# EAGLE design 516_lora_arduino_CMWX1ZZABZ (EAGLE 9.6.2)
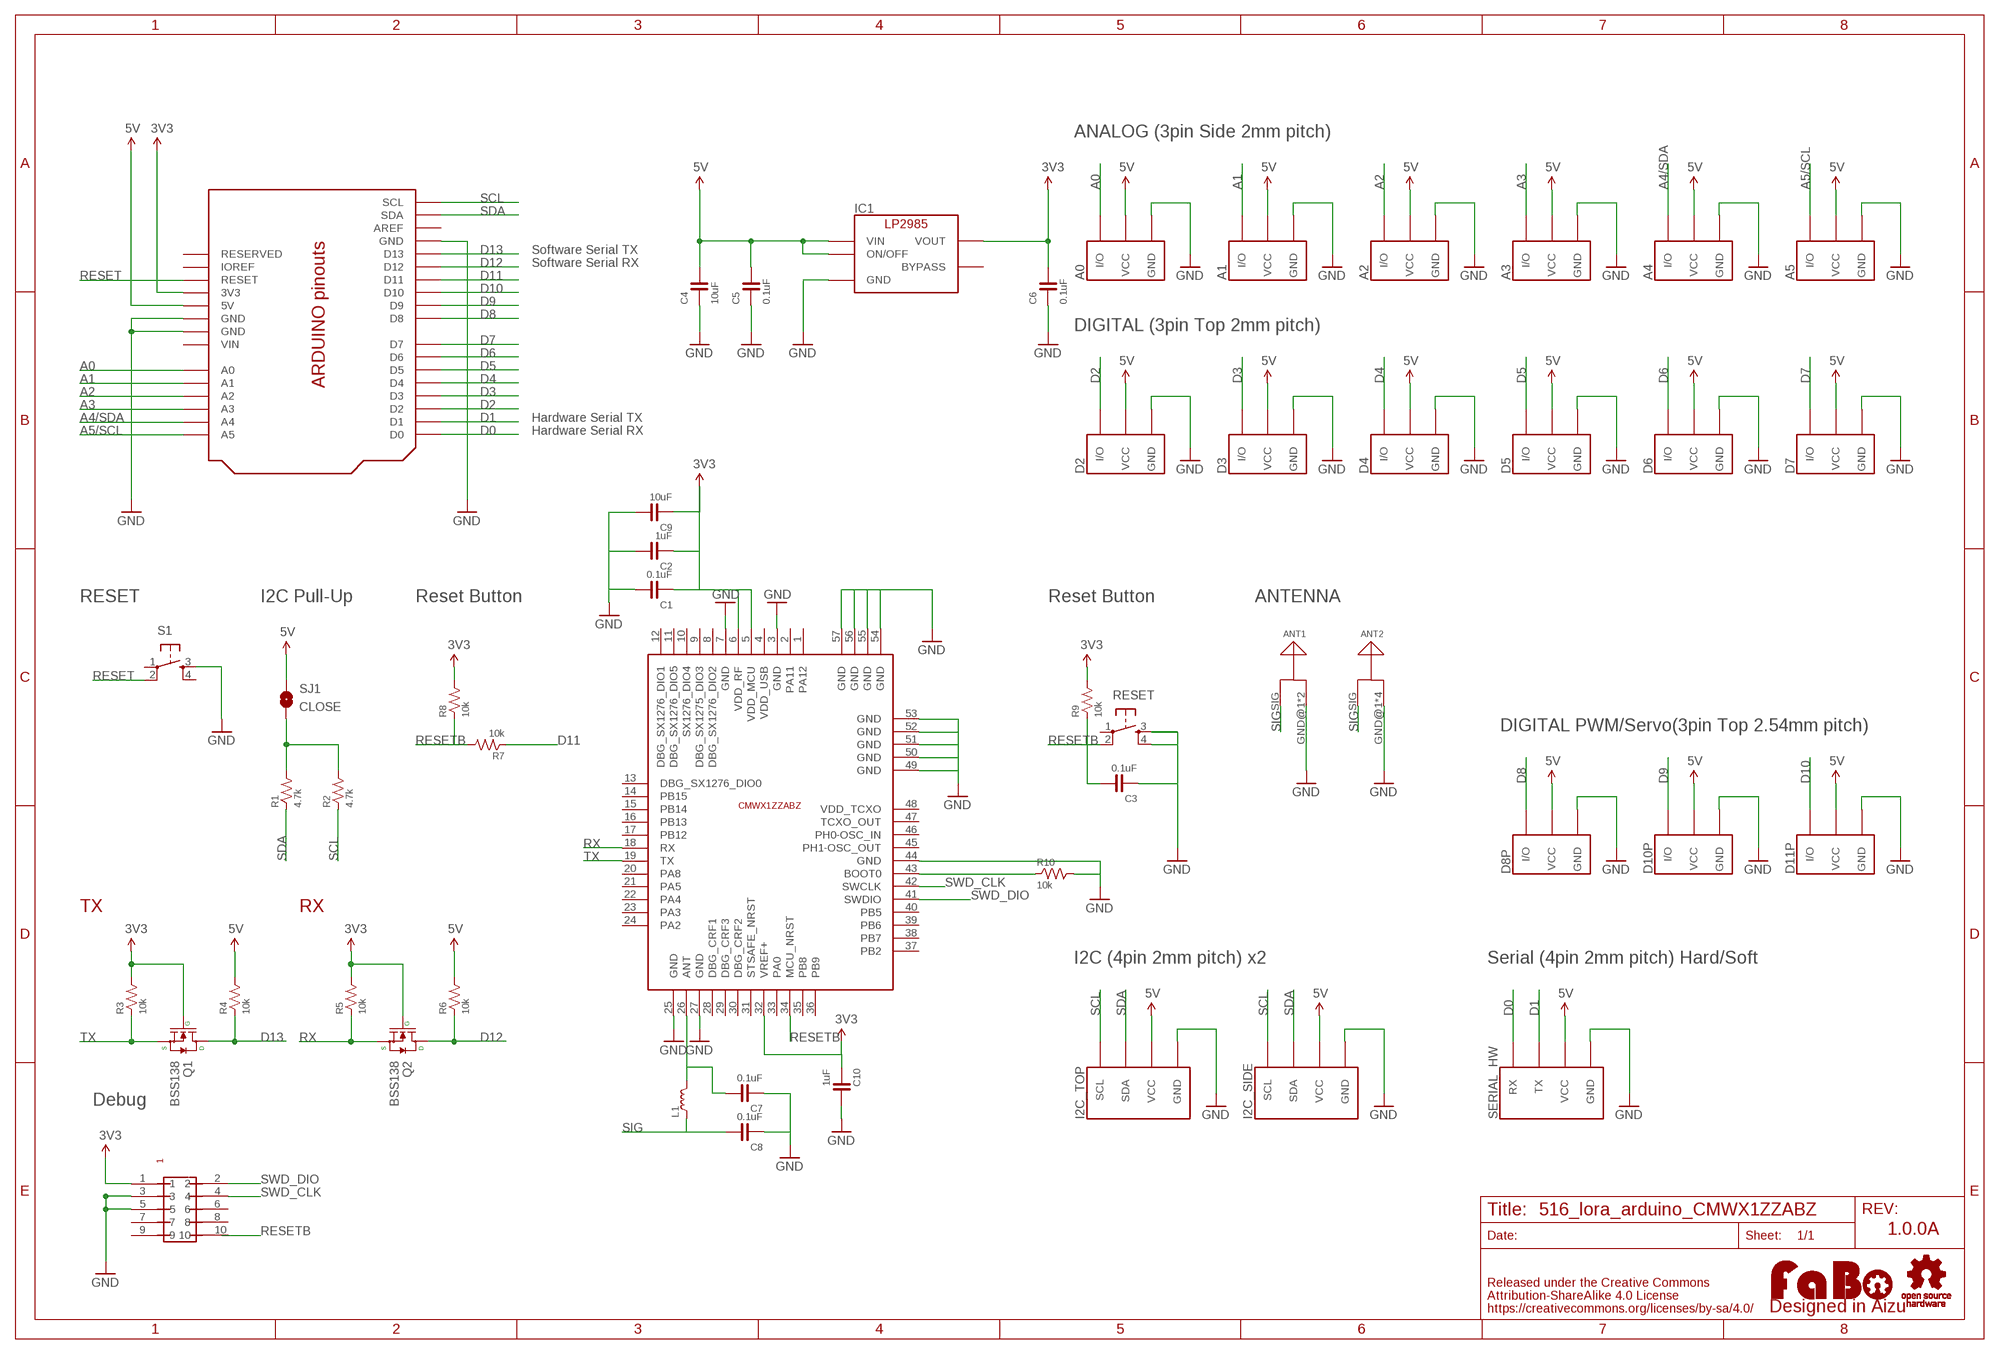
[diagram p0: schematic, sheet 1]

## Parts
A0  FABO_BRICK_3PIN-S03B-PASK-2_LONG  [FABO_BRICK_3PIN_S03B-PASK-2_LONG]
A1  FABO_BRICK_3PIN-S03B-PASK-2_LONG  [FABO_BRICK_3PIN_S03B-PASK-2_LONG]
A2  FABO_BRICK_3PIN-S03B-PASK-2_LONG  [FABO_BRICK_3PIN_S03B-PASK-2_LONG]
A3  FABO_BRICK_3PIN-S03B-PASK-2_LONG  [FABO_BRICK_3PIN_S03B-PASK-2_LONG]
A4  FABO_BRICK_3PIN-S03B-PASK-2_LONG  [FABO_BRICK_3PIN_S03B-PASK-2_LONG]
A5  FABO_BRICK_3PIN-S03B-PASK-2_LONG  [FABO_BRICK_3PIN_S03B-PASK-2_LONG]
ANT1  ANTENA_HIROSE-UF-L  [HIROSE-UF-L]
ANT2  ANTENA_SMA-J-P-H-RA-TH1  [SMA–J–P–H–RA–TH1]
C1  0.1uF  CAPACITOR-0603_NARROW  [0603-NARROW]
C2  1uF  CAPACITOR-0603_NARROW  [0603-NARROW]
C3  0.1uF  CAPACITOR-0603_NARROW  [0603-NARROW]
C4  10uF  CAPACITOR-0603_NARROW  [0603-NARROW]
C5  0.1uF  CAPACITOR-0603_NARROW  [0603-NARROW]
C6  0.1uF  CAPACITOR-0603_NARROW  [0603-NARROW]
C7  0.1uF  CAPACITOR-0603_NARROW  [0603-NARROW]
C8  0.1uF  CAPACITOR-0603_NARROW  [0603-NARROW]
C9  10uF  CAPACITOR-0603_NARROW  [0603-NARROW]
C10  1uF  CAPACITOR-0603_NARROW  [0603-NARROW]
D2  FABO_BRICK_3PIN-B03B-PASK-1  [FABO_BRICK_3PIN_B03B-PASK-1]
D3  FABO_BRICK_3PIN-B03B-PASK-1  [FABO_BRICK_3PIN_B03B-PASK-1]
D4  FABO_BRICK_3PIN-B03B-PASK-1  [FABO_BRICK_3PIN_B03B-PASK-1]
D5  FABO_BRICK_3PIN-B03B-PASK-1  [FABO_BRICK_3PIN_B03B-PASK-1]
D6  FABO_BRICK_3PIN-B03B-PASK-1  [FABO_BRICK_3PIN_B03B-PASK-1]
D7  FABO_BRICK_3PIN-B03B-PASK-1  [FABO_BRICK_3PIN_B03B-PASK-1]
D8P  FABO_BRICK_3PIN-HEADER  [FABO_BRICK_3PIN_HEADER]
D10P  FABO_BRICK_3PIN-HEADER  [FABO_BRICK_3PIN_HEADER]
D11P  FABO_BRICK_3PIN-HEADER  [FABO_BRICK_3PIN_HEADER]
I2C_SIDE  FABO_BRICK_I2C-S04B-PASK-2_LONG  [FABO_BRICK_I2C_S04B-PASK-2_LONG]
I2C_TOP  FABO_BRICK_I2C-B04B-PASK-1  [FABO_BRICK_I2C_B04B-PASK-1]
IC1  LP2985-33DBV  [SOT-23-5]
L1  COIL-0603  [0603]
LOGO1  LOGO_FABO-M  [LOGO_FABO_M]
Q1  BSS138  MOSFET-N  [SOT23-3]
Q2  BSS138  MOSFET-N  [SOT23-3]
R1  4.7k  RESISTOR-0603  [0603]
R2  4.7k  RESISTOR-0603  [0603]
R3  10k  RESISTOR-0603-NARROW  [0603-NARROW]
R4  10k  RESISTOR-0603-NARROW  [0603-NARROW]
R5  10k  RESISTOR-0603-NARROW  [0603-NARROW]
R6  10k  RESISTOR-0603-NARROW  [0603-NARROW]
R7  10k  RESISTOR-0603-NARROW  [0603-NARROW]
R8  10k  RESISTOR-0603-NARROW  [0603-NARROW]
R9  10k  RESISTOR-0603-NARROW  [0603-NARROW]
R10  10k  RESISTOR-0603-NARROW  [0603-NARROW]
RESET  TACT-SWITCH-SMD_KMR2  [KMR2]
S1  TACT-SWITCH-6MM  [DTS_6_V]
SERIAL_HW  FABO_BRICK_SERIAL-B04B-PASK-1  [FABO_BRICK_SERIAL_B04B-PASK-1]
SJ1  CLOSE  SMD-JUMPER-2-CLOSE  [SMD-JUMPER-2-CLOSE]
U1  ARDUINO_UNO_R3_SHIELD-OUTIN  [ARDUINO_SHIELD_OUTIN]
U$3  CMWX1ZZABZ  [CMWX1ZZABZ]
U$4  LOGO_OSHW-M_BOTTOM  [LOGO_OSHW_M_BOTTOM]
U$15  PIN-HEADER-SMT(1.27MM)2X5  [PIN-HEADER-SMT(1.27MM)2X5]

## Nets
3V3: C1.1 C2.1 C6.2 C9.1 C10.1 IC1.5(VOUT) Q1.1(G) Q2.1(G) R3.2 R5.2 R8.2 R9.2 U1.3V3 U$3.5(VDD_MCU) U$3.6(VDD_RF) U$3.32(VREF+) U$15.1
5V: A0.VCC A1.VCC A2.VCC A3.VCC A4.VCC A5.VCC C4.2 C5.2 D2.VCC D3.VCC D4.VCC D5.VCC D6.VCC D7.VCC D8P.VCC D10P.VCC D11P.VCC I2C_SIDE.VCC I2C_TOP.VCC IC1.1(VIN) IC1.3(ON/OFF) R4.2 R6.2 SERIAL_HW.VCC SJ1.1 U1.5V
A0: A0.I/O U1.A0
A1: A1.I/O U1.A1
A2: A2.I/O U1.A2
A3: A3.I/O U1.A3
A4/SDA: A4.I/O U1.A4
A5/SCL: A5.I/O U1.A5
D0: SERIAL_HW.RX U1.D0
D1: SERIAL_HW.TX U1.D1
D2: D2.I/O U1.D2
D3: D3.I/O U1.D3
D4: D4.I/O U1.D4
D5: D5.I/O U1.D5
D6: D6.I/O U1.D6
D7: D7.I/O U1.D7
D8: D8P.I/O U1.D8
D9: D10P.I/O U1.D9
D10: D11P.I/O U1.D10
D11: R7.1 U1.D11
D12: Q2.3(D) R6.1 U1.D12
D13: Q1.3(D) R4.1 U1.D13
GND: A0.GND A1.GND A2.GND A3.GND A4.GND A5.GND ANT1.GND@1(GND) ANT1.GND@2(GND) ANT2.GND@1(GND) ANT2.GND@2(GND) ANT2.GND@3(GND) ANT2.GND@4(GND) C1.2 C2.2 C3.1 C4.1 C5.1 C6.1 C7.1 C8.1 C9.2 C10.2 D2.GND D3.GND D4.GND D5.GND D6.GND D7.GND D8P.GND D10P.GND D11P.GND I2C_SIDE.GND I2C_TOP.GND IC1.2(GND) R10.2 RESET.3 RESET.4 S1.3 SERIAL_HW.GND U1.GND1(GND) U1.GND2(GND) U1.GND3(GND) U$3.3(GND) U$3.7(GND) U$3.25(GND) U$3.27(GND) U$3.44(GND) U$3.49(GND) U$3.50(GND) U$3.51(GND) U$3.52(GND) U$3.53(GND) U$3.54(GND) U$3.55(GND) U$3.56(GND) U$3.57(GND) U$15.3 U$15.5
N$1: R1.2 R2.2 SJ1.2
N$2: C7.2 L1.2 U$3.26(ANT)
N$5: R10.1 U$3.43(BOOT0)
RESET: S1.2 U1.RESET
RESETB: C3.2 R7.2 R8.1 R9.1 RESET.2 U$3.34(MCU_NRST) U$15.10
RX: Q2.2(S) R5.1 U$3.18(RX)
SCL: I2C_SIDE.SCL I2C_TOP.SCL R2.1 U1.SCL
SDA: I2C_SIDE.SDA I2C_TOP.SDA R1.1 U1.SDA
SIG: ANT1.SIG ANT2.SIG C8.2 L1.1
SWD_CLK: U$3.42(SWCLK) U$15.4
SWD_DIO: U$3.41(SWDIO) U$15.2
TX: Q1.2(S) R3.1 U$3.19(TX)
Unconnected: IC1.4(BYPASS) RESET.1 S1.1 S1.4 U1.AREF U1.IOREF U1.RESERVED U$3.1(PA12) U$3.2(PA11) U$3.4(VDD_USB) U$3.8(DBG_SX1276_DIO2) U$3.9(DBG_SX1275_DIO3) U$3.10(SX1276_DIO4) U$3.11(DBG_SX1276_DIO5) U$3.12(DBG_SX1276_DIO1) U$3.13(DBG_SX1276_DIO0) U$3.14(PB15) U$3.15(PB14) U$3.16(PB13) U$3.17(PB12) U$3.20(PA8) U$3.21(PA5) U$3.22(PA4) U$3.23(PA3) U$3.24(PA2) U$3.28(DBG_CRF1) U$3.29(DBG_CRF3) U$3.30(DBG_CRF2) U$3.31(STSAFE_NRST) U$3.33(PA0) U$3.35(PB8) U$3.36(PB9) U$3.37(PB2) U$3.38(PB7) U$3.39(PB6) U$3.40(PB5) U$3.45(PH1-OSC_OUT) U$3.46(PH0-OSC_IN) U$3.47(TCXO_OUT) U$3.48(VDD_TCXO) U$15.6 U$15.7 U$15.8 U$15.9

## Notes on the sheet
- ANALOG (3pin Side 2mm pitch)
- Software Serial TX
- Software Serial RX
- DIGITAL (3pin Top 2mm pitch)
- Hardware Serial TX
- Hardware Serial RX
- RESET | I2C Pull-Up | Reset Button | Reset Button | ANTENNA
- DIGITAL PWM/Servo(3pin Top 2.54mm pitch)
- TX | RX
- I2C (4pin 2mm pitch) x2 | Serial (4pin 2mm pitch) Hard/Soft
- Debug
- 1.0.0A

## Power pins joined to a net without a drawn wire
VIN: U1.VIN

## Library data of the parts
A0 A1-A5 D2-D7 D8P D10P D11P = FaBo-Template:FABO_BRICK_3PIN: FaBo Brick 3pin
ANT1 ANT2 = FaBo-Antena:ANTENA
C1-C10 = FaBo-Capacitor:CAPACITOR: CAPACITOR
I2C_SIDE I2C_TOP = FaBo-Template:FABO_BRICK_I2C: FaBo Brick I2C
IC1 = FaBo-Supply:LP2985: LP2985
L1 = FaBo-Coil:COIL: RESISTOR
LOGO1 = component:LOGO_FABO
Q1 Q2 = FaBo-etc:MOSFET-N
R1-R10 = FaBo-Resistors:RESISTOR: RESISTOR
RESET S1 = FaBo-Switch:TACT-SWITCH
SERIAL_HW = FaBo-Template:FABO_BRICK_SERIAL: FaBo Brick Serial
SJ1 = FaBo-Supply:SMD-JUMPER-2
U1 = FaBo-Boards:ARDUINO_UNO_R3_SHIELD
U$3 = FaBo-LoRa:CMWX1ZZABZ
U$4 = component:LOGO_OSHW
U$15 = GClue:PIN-HEADER-SMT(1.27MM)2X5: PIN-HEADER-SMT (1.27MM) 2x5

## Board
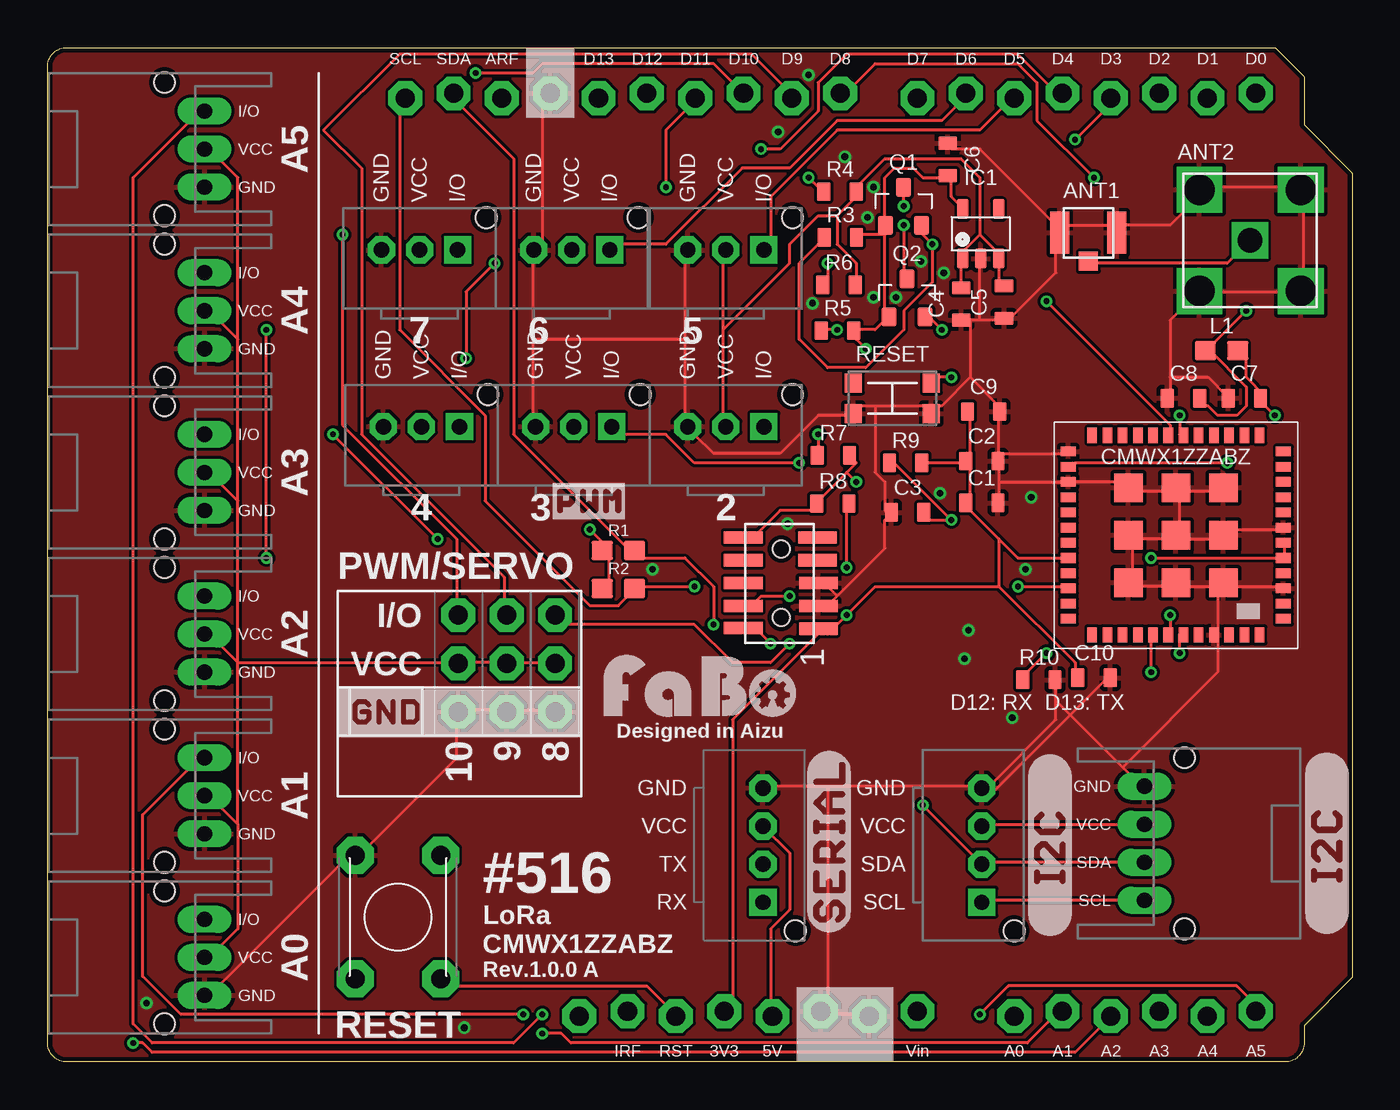
[diagram p1: board, top side]
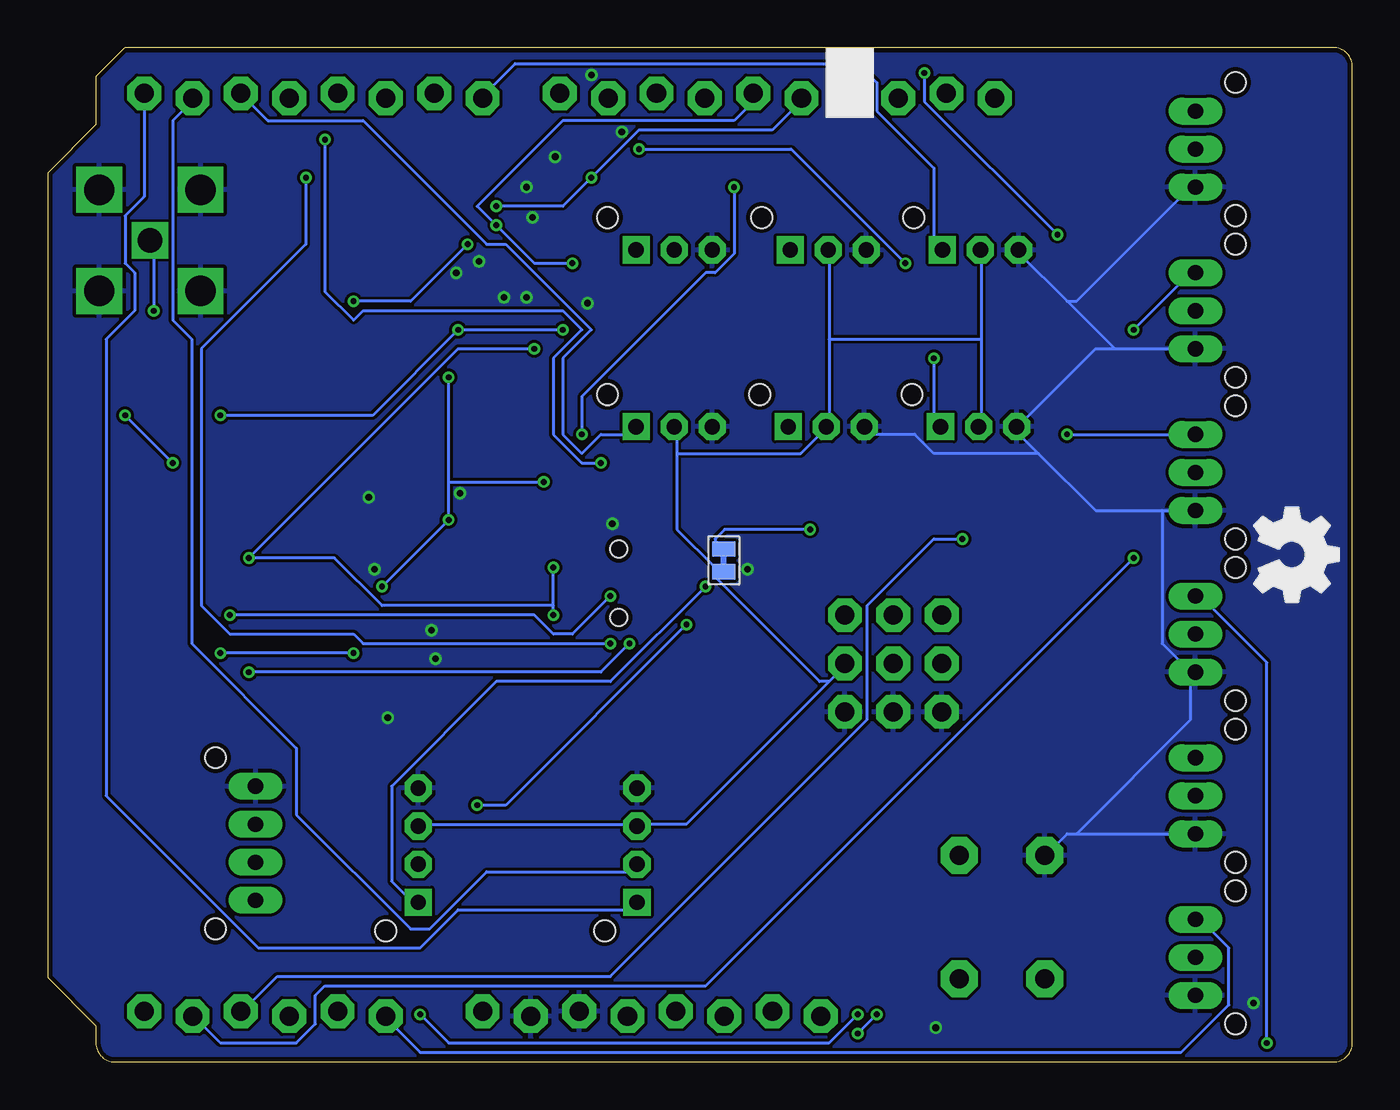
[diagram p2: board, bottom side, seen from below]

Size 68.58 x 53.34 mm. Coordinates in mm from the lower left corner, seen from the top.
Copper layers (1*16): Top 0.035mm / dielectric 1.6mm / Bottom 0.035mm
Design rules "PCBway": minimum track width 6mil, minimum drill 12mil, track to track 6mil, track to pad 6mil, pad to pad 6mil, via to via 6mil, smd to smd 6mil, copper to edge 10mil, drill to drill 10mil, minimum pad ring 10mil, minimum via ring 6mil, stop-mask expansion 2mil, vias tented up to drill 100mil, thermal gap 8mil

### Footprints (pad centres in the part's own frame; a part is rotated, then mirrored left to right if it is on the bottom)
FABO_BRICK_3PIN_S03B-PASK-2_LONG = drill 0.8 pad 1.422 long: GND -2,0; I/O 2,0; VCC 0,0 | hole 1.1: 3.5,2.1; -3.5,2.1
HIROSE-UF-L = smd 1 x 2.2: GND@1 -1.5,0; GND@2 1.5,0 | smd 1 x 1: SIG 0,-1.5
SMA–J–P–H–RA–TH1 = drill 1.6 square: GND@1 -2.665,2.665; GND@2 2.665,2.665; GND@3 -2.665,-2.665; GND@4 2.665,-2.665 | drill 1.27 square: SIG 0,0
0603-NARROW = smd 0.71 x 1: 1 -0.85,0; 2 0.85,0
FABO_BRICK_3PIN_B03B-PASK-1 = drill 0.8 pad 1.422 octagon: GND -2,0; VCC 0,0 | drill 0.8 pad 1.422 square: I/O 2,0 | hole 1.1: 3.5,1.7
FABO_BRICK_3PIN_HEADER = drill 1 pad 1.778 octagon: GND -2.54,0; I/O 2.54,0; VCC 0,0
FABO_BRICK_I2C_S04B-PASK-2_LONG = drill 0.8 pad 1.422 long: GND -3,0; SCL 3,0; SDA 1,0; VCC -1,0 | hole 1.1: 4.5,2.1; -4.5,2.1
FABO_BRICK_I2C_B04B-PASK-1 = drill 0.8 pad 1.422 octagon: GND -3,0; SDA 1,0; VCC -1,0 | drill 0.8 pad 1.422 square: SCL 3,0 | hole 1.1: 4.5,1.7
SOT-23-5 = smd 0.6 x 1.05: 1 -0.95,-1.3; 2 0,-1.3; 3 0.95,-1.3; 4 0.95,1.3; 5 -0.95,1.3
0603 = smd 1.1 x 1: 1 -0.85,0; 2 0.85,0
SOT23-3 = smd 0.8 x 1: 1 -0.95,-1; 2 0.95,-1; 3 0,1
KMR2 = smd 0.9 x 1: 1 -2.05,0.8; 2 2.05,0.8; 3 2.05,-0.8; 4 -2.05,-0.8
DTS_6_V = drill 1 pad 1.93 octagon: 1 -3.25,2.25; 2 3.25,2.25; 3 -3.25,-2.25; 4 3.25,-2.25
FABO_BRICK_SERIAL_B04B-PASK-1 = drill 0.8 pad 1.422 octagon: GND -3,0; TX 1,0; VCC -1,0 | drill 0.8 pad 1.422 square: RX 3,0 | hole 1.1: 4.5,1.7
SMD-JUMPER-2-CLOSE = smd 0.8 x 1.2: 1 -0.6,0; 2 0.6,0
ARDUINO_SHIELD_OUTIN = drill 1 pad 1.778 octagon: 3V3 35.56,2.667; 5V 38.1,2.413; A0 50.8,2.413; A1 53.34,2.667; A2 55.88,2.413; A3 58.42,2.667; A4 60.96,2.413; A5 63.5,2.667; AREF 23.876,50.673; D0 63.5,50.927; D1 60.96,50.673; D2 58.42,50.927; D3 55.88,50.673; D4 53.34,50.927; D5 50.8,50.673; D6 48.26,50.927; D7 45.72,50.673; D8 41.656,50.927; D9 39.116,50.673; D10 36.576,50.927; D11 34.036,50.673; D12 31.496,50.927; D13 28.956,50.673; GND1 43.18,2.413; GND2 40.64,2.667; GND3 26.416,50.927; IOREF 30.48,2.667; RESERVED 27.94,2.413; RESET 33.02,2.413; SCL 18.796,50.673; SDA 21.336,50.927; VIN 45.72,2.667
CMWX1ZZABZ = smd 0.8 x 0.5: 1 -5.65,4.4; 2 -5.65,3.6; 3 -5.65,2.8; 4 -5.65,2; 5 -5.65,1.2; 6 -5.65,0.4; 7 -5.65,-0.4; 8 -5.65,-1.2; 9 -5.65,-2; 10 -5.65,-2.8; 11 -5.65,-3.6; 12 -5.65,-4.4; 25 5.65,-4.4; 26 5.65,-3.6; 27 5.65,-2.8; 28 5.65,-2; 29 5.65,-1.2; 30 5.65,-0.4; 31 5.65,0.4; 32 5.65,1.2; 33 5.65,2; 34 5.65,2.8; 35 5.65,3.6; 36 5.65,4.4 | smd 0.5 x 0.8: 13 -4.4,-5.25; 14 -3.6,-5.25; 15 -2.8,-5.25; 16 -2,-5.25; 17 -1.2,-5.25; 18 -0.4,-5.25; 19 0.4,-5.25; 20 1.2,-5.25; 21 2,-5.25; 22 2.8,-5.25; 23 3.6,-5.25; 24 4.4,-5.25; 37 4.4,5.25; 38 3.6,5.25; 39 2.8,5.25; 40 2,5.25; 41 1.2,5.25; 42 0.4,5.25; 43 -0.4,5.25; 44 -2,5.25; 45 -1.2,5.25; 46 -2.8,5.25; 47 -3.6,5.25; 48 -4.4,5.25 | smd 1.5 x 1.5: 49 -2.5,2.5; 50 0,2.5; 51 2.5,2.5; 52 -2.5,0; 53 0,0; 54 2.5,0; 55 -2.5,-2.5; 56 0,-2.5; 57 2.5,-2.5
PIN-HEADER-SMT(1.27MM)2X5 = smd 0.635 x 2.032: 1 -2.4,-1.95; 2 -2.35,2; 3 -1.2,-1.95; 4 -1.2,2; 5 0,-1.95; 6 0,2; 7 1.2,-1.9; 8 1.2,2; 9 2.4,-1.9; 10 2.4,2 | hole 0.9: 1.8,0; -1.8,0

### Placement (x,y rotation side)
A0  8.25,5.5 90 top
A1  8.25,14 90 top
A2  8.25,22.5 90 top
A3  8.25,31 90 top
A4  8.25,39.5 90 top
A5  8.25,48 90 top
ANT1  54.7,43.6 0 top
ANT2  63.2,43.2 0 top
C1  49.1,29.4 0 top
C2  49.1,31.6 0 top
C3  45.2,28.9 0 top
C4  48.02,39.85 90 top
C5  50.27,39.95 90 top
C6  47.31,47.45 270 top
C7  62.9,34.9 0 top
C8  59.7,34.9 0 top
C9  49.2,34.2 0 top
C10  55,20.2 0 top
D2  35.65,33.4 0 top
D3  27.65,33.4 0 top
D4  19.65,33.4 0 top
D5  35.65,42.7 0 top
D6  27.55,42.7 0 top
D7  19.55,42.7 0 top
D8P  26.67,20.95 90 top
D10P  24.13,20.95 90 top
D11P  21.59,20.95 90 top
I2C_SIDE  57.65,11.5 270 top
I2C_TOP  49.1,11.4 270 top
IC1  49.04,43.55 0 top
L1  61.7,37.4 0 top
LOGO1  34.29,17.78 0 top
Q1  44.98,44.98 0 top
Q2  45.16,40.19 0 top
R1  30,26.9 180 top
R2  30,24.9 180 top
R3  41.67,43.36 0 top
R4  41.65,45.76 0 top
R5  41.52,38.46 0 top
R6  41.59,40.86 0 top
R7  41.3,31.9 0 top
R8  41.27,29.36 0 top
R9  45.1,31.5 0 top
R10  52.1,20.1 0 top
RESET  44.4,34.9 0 top
S1  18.41,7.62 270 top
SERIAL_HW  37.6,11.4 270 top
SJ1  33.03,26.37 90 bottom
U1  0,0 0 top
U$2  [LOGO_SILK_SERIAL2]  42.25,11.6 90 top
U$3  59.3,27.7 180 top
U$4  3.17,26.67 90 top
U$5  [LOGO_SILK_PWM]  26.55,28.55 0 top
U$11  [LOGO_SILK_I2C]  68.4,11.5 90 top
U$12  [LOGO_SILK_I2C]  53.85,11.4 90 top
U$15  38.56,25.18 90 top
U$19  [LOGO_SILK_GND]  15.88,17.14 0 top

### Tracks (layer width: path | path; a pad name or v marks a point on that pad's centre or on a via)
3V3  (via drill 0.3)
  Top 0.152: R9.2 48,31.5 C2.1 | C9.1 48.5,34 48.5,32 C2.1 | U$3.32 51,26.5 50,27.5 | 50,27.5 48.5,29 C1.1 48.5,29.5 48.5,31.5 C2.1 | 50,25 54,21 54,20.5 C10.1 | 50,27.5 50,25 | IC1.5 48,45 47.5,45.5 47.5,46.5 C6.2 47,46.5 46,46.5 45.5,47 44.5,47 44,46.5 44,44 Q1.1 44,43.5 | 44,43.5 42.5,43.5 R3.2 | 44,43.5 44,39.5 Q2.1 44,39 43.5,38.5 42.5,38.5 R5.2 42.5,38 v43,37.5 | U$3.6 65,27.5 65,26.5 U$3.5 v58,26.5 | v42,26 42,29 R8.2 | U1.3V3 36,3 36,18 40.5,22.5 U$15.1 41,22.5 v42,23.5 43.5,25 50,25
  Bottom 0.152: v42,23.5 42,24 | 42,24 v42,26 | 42,24 51,24 53.5,26.5 v58,26.5 47,37.5 v43,37.5
5V
  Top 0.152: C4.2 48,41 48,42 IC1.1 48,42.5 49,43.5 | C5.2 50,41 50,42 IC1.3 50,42.5 49,43.5 | 41.5,44.5 41.5,43 42.5,42 42.5,41 R6.2 | 41.5,44.5 42.5,45.5 R4.2 42.5,46 44,47.5 48,47.5 49,46.5 49,43.5 | 35.5,38.5 35.5,33.5 D2.VCC | 35.5,38.5 35.5,42.5 D5.VCC | 41.5,44.5 40.5,44.5 39,43 39,42 35.5,38.5 | I2C_SIDE.VCC 49.5,12.5 I2C_TOP.VCC | SERIAL_HW.VCC 39,11 39,8 38,7 38,2.5 U1.5V | D8P.VCC 26.5,21 24.5,21 D10P.VCC 24,21 22,21 D11P.VCC 21.5,21 10,21 | 10,12.5 10,7 8.5,5.5 A0.VCC | 10,12.5 8.5,14 A1.VCC | 10,21 8.5,22.5 A2.VCC | 10,12.5 10,21 | 10,29.5 8.5,31 A3.VCC | 10,21 10,29.5 | 10,38 8.5,39.5 A4.VCC | 10,29.5 10,38 | 10,38 10,46.5 8.5,48 A5.VCC
  Bottom 0.152: 19.5,38 19.5,42.5 D7.VCC | 19.5,38 19.5,33.5 D4.VCC | 27.5,38 27.5,42.5 D6.VCC | 27.5,38 27.5,33.5 D3.VCC 28,33 29,32 35.5,32 | 27.5,38 19.5,38 | 35.5,32 35.5,33 D2.VCC | 35.5,32 35.5,28 33.5,26 SJ1.1 33.5,25.5 28,20 27.5,20 | I2C_TOP.VCC 49,12.5 38,12.5 SERIAL_HW.VCC 37.5,12.5 35,12.5 27.5,20 | 27.5,20 27,20.5 D8P.VCC
A0
  Bottom 0.152: A0.I/O 8,7.5 6.5,6 6.5,3 9,0.5 49,0.5 50.5,2 U1.A0
A1  (via drill 0.3)
  Top 0.152: v25,2.5 7,2.5 5,4.5 5,13 8,16 A1.I/O | v26,1.5 27,1.5 27.5,1 51.5,1 53,2.5 U1.A1
  Bottom 0.152: v26,1.5 v25,2.5
A2  (via drill 0.3)
  Top 0.152: v4.5,1 5,1 5.5,0.5 54,0.5 55.5,2 U1.A2
  Bottom 0.152: v4.5,1 4.5,21 8,24.5 A2.I/O
A3  (via drill 0.3)
  Top 0.152: v20.5,27.5 v15,33
  Bottom 0.152: v15,33 A3.I/O | v20.5,27.5 22,27.5 25.5,24 25.5,18 39,4.5 56.5,4.5 58,3 U1.A3
A4/SDA  (via drill 0.3)
  Top 0.152: v11.5,26.5 v11.5,38.5
  Bottom 0.152: v11.5,38.5 8.5,41.5 A4.I/O | v11.5,26.5 34,4 54,4 54.5,3.5 54.5,2 55.5,1 59.5,1 60.5,2 U1.A4
A5/SCL  (via drill 0.3)
  Top 0.152: v26,2.5 24.5,1 5.5,1 4.5,2 4.5,46.5 8,50 A5.I/O | v49,2.5 50.5,4 62.5,4 63.5,3 U1.A5
  Bottom 0.152: v26,2.5 27.5,1 47.5,1 v49,2.5
D0
  Bottom 0.152: U1.D0 63.5,45.5 64.5,44.5 64.5,42 64,41.5 64,39.5 65.5,38 65.5,14 57.5,6 49,6 47,8 38,8 SERIAL_HW.RX
D1
  Bottom 0.152: SERIAL_HW.TX 38,10 45.5,10 48.5,7 49.5,7 55.5,13 55.5,16.5 61,22 61,38 62,39 62,49.5 61,50.5 U1.D1
D2
  Bottom 0.152: D2.I/O 38,33 39.5,33 40.5,32 41.5,33 41.5,37 40,38.5 44.5,43 45.5,43 52,49.5 57,49.5 58,50.5 U1.D2
D3  (via drill 0.3)
  Top 0.152: v39.5,31.5 34,31.5 32.5,33 30,33 D3.I/O | v54,48.5 56,50.5 U1.D3
  Bottom 0.152: v39.5,31.5 40.5,31.5 42,33 42,37 40.5,38.5 41.5,39.5 52,39.5 52.5,39 54,40.5 v54,48.5
D4  (via drill 0.3)
  Top 0.152: v22,37 22,40.5 v23.5,42 | v37.5,48 38.5,48 40.5,50 40.5,51.5 42,53 51,53 53,51 U1.D4
  Bottom 0.152: v22,37 22,33.5 D4.I/O | v23.5,42 29.5,48 v37.5,48
D5
  Top 0.152: D5.I/O 38,43 38,45.5 41.5,49 49,49 50.5,50.5 U1.D5
D6
  Top 0.152: D6.I/O 30,43 32.5,43 36.5,47 39,47 41.5,49.5 47,49.5 48,50.5 U1.D6
D7
  Bottom 0.152: D7.I/O 22,43 22,47 25,50 25,51.5 26,52.5 44,52.5 45.5,51 U1.D7
D8  (via drill 0.3)
  Top 0.152: v39,22 38,21 36,21 34,23 27,23 D8P.I/O | v55,46.5 52,49.5 52,51.5 51,52.5 43.5,52.5 42,51 U1.D8
  Bottom 0.152: v39,22 52,22 52.5,22.5 59,22.5 60.5,24 60.5,37.5 55,43 v55,46.5
D9
  Top 0.152: D10P.I/O 24,23.5 24,25.5 16.5,33 16.5,47 14.5,49 18.5,53 37,53 39,51 U1.D9
D10  (via drill 0.3)
  Top 0.152: v15.5,43.5 15.5,33.5 21.5,27.5 21.5,23.5 D11P.I/O | v22.5,52 25.5,52 26,52.5 35,52.5 36.5,51 U1.D10
  Bottom 0.152: v15.5,43.5 22.5,50.5 v22.5,52
D11  (via drill 0.3)
  Top 0.152: v40.5,33 40.5,32 R7.1 | v32.5,46 32.5,49 34,50.5 U1.D11
  Bottom 0.152: v40.5,33 40.5,35 34,41.5 33.5,41.5 32.5,42.5 v32.5,46
D12  (via drill 0.3)
  Top 0.152: v41,42 41,41 R6.1 | v45,44 45,41.5 Q2.3
  Bottom 0.152: v41,42 43,42 v45,44 46,45 41.5,49.5 32.5,49.5 31.5,50.5 U1.D12
D13  (via drill 0.3)
  Top 0.152: v40,46.5 40.5,46 R4.1 | v45,45 45,45.5 Q1.3
  Bottom 0.152: U1.D13 29,50.5 30.5,49 37.5,49 v40,46.5 41.5,45 v45,45
GND  (via drill 0.35)
  Top 0.152: D8P.GND 26.5,18.5 24.5,18.5 D10P.GND 24,18.5 22,18.5 D11P.GND 21.5,18 21.5,16 16.5,11 S1.3 16,11 8.5,3.5 A0.GND | 33.5,38 33.5,42.5 D5.GND | 33.5,38 33.5,33.5 D2.GND 34,33 35,32 38.5,32 40.5,34 42,34 RESET.4 42.5,34.5 43.5,34.5 | U1.GND3 26,50.5 26,43 D6.GND 25.5,42.5 25.5,38 | 25.5,38 25.5,33.5 D3.GND | 25.5,38 33.5,38 | U1.GND1 43,2.5 41,2.5 U1.GND2 41,3 41,14.5 | 53,19 53,18 49.5,14.5 I2C_TOP.GND | 53,19 53,20 R10.2 | C10.2 55.5,20 49.5,14 I2C_TOP.GND | 41,14.5 49,14.5 I2C_TOP.GND | 41,14.5 38,14.5 SERIAL_HW.GND | 53,19 56.5,15.5 | 56.5,15.5 57.5,14.5 I2C_SIDE.GND | 59,36 59,39 ANT2.GND@3 61,40.5 65.5,40.5 ANT2.GND@4 66,41 66,45.5 ANT2.GND@2 65.5,46 61,46 ANT2.GND@1 60.5,45.5 59,44 56.5,44 ANT1.GND@2 56,44 53.5,44 ANT1.GND@1 | 59,36 59,35 C8.1 | 59,36 61,36 62,35 C7.1 | C6.1 47.5,48 49,48 53,44 ANT1.GND@1 | 61.5,25 61.5,22.5 | U$3.3 65,25 62,25 U$3.49 61.5,25 | U$3.7 65,28 62,28 U$3.52 61.5,27.5 59.5,27.5 U$3.53 | 59.5,30 61.5,30 U$3.55 | 57,27.5 59,27.5 U$3.53 | 57,27.5 57,25.5 U$3.51 57,25 59,25 U$3.50 59.5,25 61.5,25 | 57,27.5 U$3.54 | 59.5,30 59.5,28 U$3.53 | 59.5,30 U$3.56 59,30 57,30 U$3.57 56.5,30.5 U$3.27 50,30.5 | 41.5,24.5 41,24 U$15.3 | 41.5,24.5 44,27 44,28.5 C3.1 44,29 44,30.5 43.5,31 43.5,34.5 | 41.5,24.5 41,25 U$15.5 | 50,32 53.5,32 U$3.25 | 50,30.5 50,31.5 C2.2 50,32 | 50,30.5 50,29.5 C1.2 | 50,32 50,34 C9.2 50,34.5 48.5,36 | 46.5,34.5 43.5,34.5 | 49,39 50,39 C5.1 50.5,39 53,41.5 53,43.5 ANT1.GND@1 | 49,39 48.5,39 | 49,39 49,42 IC1.2 | 46.5,34.5 47,34.5 48.5,36 | 48.5,39 48.5,36 | 46.5,34.5 RESET.3 | 48.5,39 C4.1 | 56.5,15.5 61.5,20.5 61.5,22.5 | 61.5,22.5 U$3.44
  Bottom 0.152: 14.5,12 15,12 16,11 S1.3 | 14.5,12 A1.GND | 8.5,20.5 8.5,18 14.5,12 | 10,29 13.5,29 16.5,32 | 10,29 A3.GND | 16.5,32 17.5,33 D4.GND 17.5,33.5 13.5,37.5 12.5,37.5 | 12.5,37.5 A4.GND | 12.5,37.5 15,40 | 15,40 17.5,42.5 D7.GND | 15,40 14.5,40 8.5,46 A5.GND | 16.5,32 22,32 23,33 25.5,33 D3.GND | 8.5,20.5 10,22 10,29 | 8.5,20.5 A2.GND
  other vias: 51.7,29.7 51.4,25.9 48.4,22.7 50.7,18.1 48.2,21.2 41.9,47.6 43.4,40.2 21.9,1.8 38.9,28.3 31.8,25.9 40,51.9 43.4,46 43.1,44.4 47.1,41.5 45.9,42.1 44.6,40.2 40.2,39.9 46.9,29.9 38.4,48.9 5.2,3.1
  pour Bottom: 0,0 0,53.34 1.27,53.34 68.58,53.34 68.58,0
  pour Top: 0,0 0,53.34 68.58,53.34 68.58,0
N$1  (via drill 0.3)
  Top 0.152: R2.2 29.5,25 29.5,26.5 R1.2 29.5,27 v28.5,28
  Bottom 0.152: v28.5,28 33,28 33.5,27.5 33.5,27 SJ1.2
N$2  (via drill 0.3)
  Top 0.152: v62,31.5 54,31.5 U$3.26 | v64.5,34 64,34.5 C7.2 64,35 63,36 63,37 L1.2
  Bottom 0.152: v64.5,34 v62,31.5
N$5  (via drill 0.3)
  Top 0.152: v59.5,21.5 59.5,22.5 U$3.43 | v52.5,21.5 51.5,20.5 R10.1
  Bottom 0.152: v52.5,21.5 v59.5,21.5
RESET
  Top 0.152: U1.RESET 33,2.5 31.5,4 21,4 S1.2
RESETB  (via drill 0.3)
  Top 0.152: 42,31 42.5,31.5 R7.2 | 42,31 40.5,29.5 R8.1 40.5,29 38.5,29 37,27.5 U$15.10 | v51,25 53.5,25 U$3.34 | C3.2 46,28.5 v47.5,28.5 44.5,31.5 R9.1 | v47.5,36 46.5,36 RESET.2 | v42.5,30.5 42,31
  Bottom 0.152: v51,25 v47.5,28.5 47.5,30.5 | 47.5,30.5 v47.5,36 | 47.5,30.5 v42.5,30.5
RX  (via drill 0.3)
  Top 0.152: v59.5,34 59.5,33 U$3.18 | v47,38.5 46.5,39 Q2.2 | v41.5,38.5 41,38.5 R5.1
  Bottom 0.152: v59.5,34 51.5,34 v47,38.5 v41.5,38.5
SCL  (via drill 0.3)
  Top 0.152: I2C_SIDE.SCL 49.5,8.5 I2C_TOP.SCL | U1.SCL 18.5,50.5 18.5,38.5 23,34 23,29.5 28.5,24 30,24 30.5,24.5 R2.1 31,25 v34,25
  Bottom 0.152: v34,25 39,20 45,20 50.5,14.5 50.5,9.5 49.5,8.5 I2C_TOP.SCL
SDA  (via drill 0.3)
  Top 0.152: I2C_SIDE.SDA 49.5,10.5 I2C_TOP.SDA v46,13.5 | U1.SDA 21.5,50.5 24.5,47.5 24.5,33 30.5,27 R1.1 31,26.5 33.5,26.5 35,25 v35,23
  Bottom 0.152: v46,13.5 44.5,13.5 v35,23
SIG  (via drill 0.3)
  Top 0.152: 61,37.5 63,35.5 63,34.5 62.5,34 61.5,34 61,34.5 60.5,34.5 C8.2 | ANT2.SIG 62,42 55,42 ANT1.SIG | v63,39.5 61,37.5 | 61,37.5 L1.1
  Bottom 0.152: v63,39.5 63,43 ANT2.SIG
SWD_CLK  (via drill 0.3)
  Top 0.152: v59,23.5 59,22.5 U$3.42 | v39,24.5 37.5,24.5 37,24 U$15.4
  Bottom 0.152: v59,23.5 43,23.5 42,22.5 41,22.5 v39,24.5
SWD_DIO  (via drill 0.3)
  Top 0.152: v58,20.5 58,22.5 U$3.41 | v38,22 37,23 U$15.2
  Bottom 0.152: v58,20.5 39.5,20.5 v38,22
TX  (via drill 0.3)
  Top 0.152: v52.5,40 59,33.5 59,33 U$3.19 | Q1.2 46,43.5 v46.5,43 46.5,41 45,39.5 45,38.5 43,36.5 41,36.5 39.5,38 39.5,42 40.5,43 R3.1
  Bottom 0.152: v52.5,40 49.5,40 v46.5,43

### Text on the board
tPlace: SCL | SDA | ARF | D13 | D12 | D11 | D10 | D9 | D8 | D7 | D6 | D5 | D4 | D3 | D2 | D1 | D0 | I/O | VCC | GND | GND | VCC | I/O | GND | VCC | I/O | GND | VCC | I/O | I/O | VCC | 7 | 6 | 5 | GND | GND | VCC | I/O | GND | VCC | I/O | GND | VCC | I/O | I/O | VCC | 4 | 3 | 2 | GND | PWM/SERVO | I/O | I/O | VCC | VCC | GND | D12: RX D13: TX | Designed in Aizu | 10 | 9 | 8 | I/O | VCC | GND | GND | GND | GND | VCC | VCC | VCC | TX | SDA | SDA | #516 | I/O | RX | SCL | SCL | VCC | LoRa / CMWX1ZZABZ | GND | Rev.1.0.0 A | RESET | IRF | RST | 3V3 | 5V | Vin | A0 | A1 | A2 | A3 | A4 | A5